# Altium schematic sheet SDRAM.SchDoc
size A
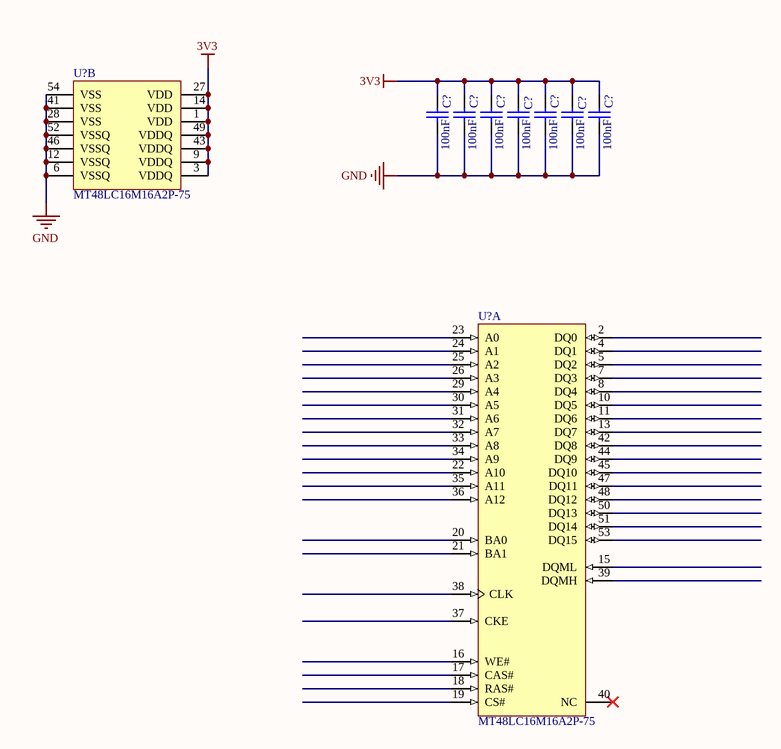
[diagram p0: SDRAM.SchDoc]

## Parts
(Parts that share a designator on the sheet are numbered #1, #2 ... from top to bottom, then left to right.)
C?#1  value 100nF  [0805]  (hidden comment: C0805)
C?#2  value 100nF  [0805]  (hidden comment: C0805)
C?#3  value 100nF  [0805]  (hidden comment: C0805)
C?#4  value 100nF  [0805]  (hidden comment: C0805)
C?#5  value 100nF  [0805]  (hidden comment: C0805)
C?#6  value 100nF  [0805]  (hidden comment: C0805)
C?#7  value 100nF  [0805]  (hidden comment: C0805)
U?#1  MT48LC16M16A2P-75  [MICT-P-54_N]  (part B of 2)
U?#2  MT48LC16M16A2P-75  [MICT-P-54_N]  (part A of 2)

## Nets
3V3: C?#1.1 C?#2.1 C?#3.1 C?#4.1 C?#5.1 C?#6.1 C?#7.1 U?#1.1(VDD) U?#1.3(VDDQ) U?#1.9(VDDQ) U?#1.14(VDD) U?#1.27(VDD) U?#1.43(VDDQ) U?#1.49(VDDQ)
GND: C?#1.2 C?#2.2 C?#3.2 C?#4.2 C?#5.2 C?#6.2 C?#7.2 U?#1.6(VSSQ) U?#1.12(VSSQ) U?#1.28(VSS) U?#1.41(VSS) U?#1.46(VSSQ) U?#1.52(VSSQ) U?#1.54(VSS)

Not connected (* = marked no-connect by the designer): U?#2 2(DQ0) 4(DQ1) 5(DQ2) 7(DQ3) 8(DQ4) 10(DQ5) 11(DQ6) 13(DQ7) 15(DQML) 16(WE#) 17(CAS#) 18(RAS#) 19(CS#) 20(BA0) 21(BA1) 22(A10) 23(A0) 24(A1) 25(A2) 26(A3) 29(A4) 30(A5) 31(A6) 32(A7) 33(A8) 34(A9) 35(A11) 36(A12) 37(CKE) 38(CLK) 39(DQMH) 40(NC)* 42(DQ8) 44(DQ9) 45(DQ10) 47(DQ11) 48(DQ12) 50(DQ13) 51(DQ14) 53(DQ15)

## Notes on the sheet
- Engineer:
- Title:
- Saleh Jamali
- Revision:

## Library data of the parts
C?#1-C?#7 = C0805: Ceramic Chip Capacitor - Standard; Note: Footprint corresponds to dimensions for bulk cassette packaging. This case size has tightened tolerances.; Published: 17-Jul-2002; LatestRevisionDate: 19-Mar-2004; LatestRevisionNote: Silkscreen size reduced.; DatasheetDocument: Mar-2001; PackageDocument: Mar-2001; PackageReference: 0805; Publisher: Altium Limited; Code_JEITA: 0805; Code_IPC: 2012[0805]; ComponentLink1Description: Manufacturer Link; ComponentLink1URL: http://www.kemet.com/; ComponentLink2Description: Datasheet; ComponentLink2URL: http://www.kemet.com/kemet/web/homepage/kechome.nsf/vapubfilesname/F3102TA.pdf/$file/F3102TA.pdf
U?#1 U?#2 = MT48LC16M16A2P-75: 256Mb PC133 SDR SDRAM, 16Mb x 16, 7.5ns, 3.3V, 0C to 70 degC, 54-Pin TSOP, Pb-Free; Manufacturer: Micron; CL: CL = 3; Clock Rate: 133 MHz; Op. Temp.: 0C to +70C; DatasheetVersion: Rev.Q; PackageVersion: Rev.Q; PackageReference: MICT-P-54; PackageDescription: 54-Pin Thin Small Outline Package, 10.16 x 22.22 mm, Pitch 0.8 mm; Cycle Time: 7.5ns; Data Rate: PC133; Density: 256Mb; Depth: 16Mb; RoHS: Yes; Voltage: 3.3V; Width: x16; Mounting Technology: Surface Mount; PartNumber: MT48LC16M16A2P-75; ComponentLink1Description: Manufacturer URL; ComponentLink1URL: http://www.micron.com/; ComponentLink2Description: Datasheet; ComponentLink2URL: http://www.micron.com/~/media/Documents/Products/Data%20Sheet/DRAM/256Mb_sdr.pdf; ComponentLink3Description: Package Specification; ComponentLink3URL: http://www.micron.com/~/media/Documents/Products/Data%20Sheet/DRAM/128mb_x4x8x16_sdram.pdf